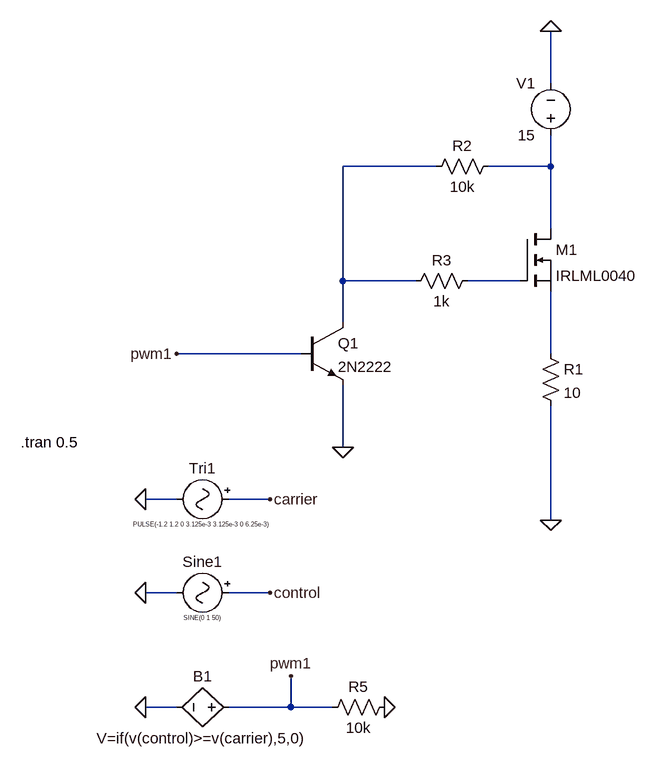
[diagram p0: schematic Bootstrapping.asc]
Bootstrapping.asc, the LTspice schematic file:
Version 4
SHEET 1 880 1016
WIRE 480 -80 480 -160
WIRE 304 48 160 48
WIRE 480 48 480 0
WIRE 480 48 384 48
WIRE 480 144 480 48
WIRE 160 224 160 48
WIRE 272 224 160 224
WIRE 432 224 352 224
WIRE 160 288 160 224
WIRE 96 336 -96 336
WIRE 480 336 480 240
WIRE 160 480 160 384
WIRE -96 560 -144 560
WIRE 48 560 -16 560
WIRE 480 592 480 416
WIRE -96 704 -144 704
WIRE 48 704 -16 704
WIRE -96 880 -144 880
WIRE 80 880 80 832
WIRE 80 880 -16 880
WIRE 144 880 80 880
FLAG 480 -160 0
FLAG 480 592 0
FLAG 160 480 0
FLAG -144 560 0
FLAG -144 704 0
FLAG 48 560 carrier
FLAG 48 704 control
FLAG -144 880 0
FLAG 224 880 0
FLAG 80 832 pwm1
FLAG -96 336 pwm1
SYMBOL nmos 432 144 R0
SYMATTR InstName M1
SYMATTR Value IRLML0040
SYMBOL Res 464 320 R0
SYMATTR InstName R1
SYMATTR Value 10
SYMBOL voltage 480 16 R180
WINDOW 0 24 96 Left 2
WINDOW 3 24 16 Left 2
SYMATTR InstName V1
SYMATTR Value 15
SYMBOL npn 96 288 R0
SYMATTR InstName Q1
SYMATTR Value 2N2222
SYMBOL signal 0 560 R90
WINDOW 0 -32 56 VBottom 2
WINDOW 3 32 56 VTop 0
SYMATTR InstName Tri1
SYMATTR Value PULSE(-1.2 1.2 0 3.125e-3 3.125e-3 0 6.25e-3)
SYMBOL signal 0 704 R90
WINDOW 0 -32 56 VBottom 2
WINDOW 3 32 56 VTop 0
SYMATTR InstName Sine1
SYMATTR Value SINE(0 1 50)
SYMBOL bv 0 880 R90
WINDOW 0 -32 56 VBottom 2
WINDOW 3 32 56 VTop 2
SYMATTR InstName B1
SYMATTR Value V=if(v(control)>=v(carrier),5,0)
SYMBOL Res 240 864 R90
WINDOW 0 0 56 VBottom 2
WINDOW 3 32 56 VTop 2
SYMATTR InstName R5
SYMATTR Value 10k
SYMBOL Res 400 32 R90
WINDOW 0 0 56 VBottom 2
WINDOW 3 32 56 VTop 2
SYMATTR InstName R2
SYMATTR Value 10k
SYMBOL Res 368 208 R90
WINDOW 0 0 56 VBottom 2
WINDOW 3 32 56 VTop 2
SYMATTR InstName R3
SYMATTR Value 1k
TEXT -336 472 Left 2 !.tran 0.5

The netlist it stands for:
* Bootstrapping.asc
M1 N002 N003 N004 N004 IRLML0040
R1 N004 0 10
V1 N002 0 15
Q1 N001 pwm1 0 0 2N2222
V§Tri1 carrier 0 PULSE(-1.2 1.2 0 3.125e-3 3.125e-3 0 6.25e-3)
V§Sine1 control 0 SINE(0 1 50)
B1 pwm1 0 V=if(v(control)>=v(carrier),5,0)
R5 0 pwm1 10k
R2 N002 N001 10k
R3 N003 N001 1k
.model NPN NPN
.model PNP PNP
.lib standard.bjt
.model NMOS NMOS
.model PMOS PMOS
.lib standard.mos
.tran 0.5
.backanno
.end